# EasyEDA Pro project ProDocument_灰度传感器_2023-07-26.epro

# Schematic v1
Create Date: 2023-07-21; Page Name: P1; Project Name: 【2023电赛】2023年电赛控制术; Schematic Name: v1; Update Date: 2023-07-22; Company: 桂林信息科技学院; Drawed: Jsir2022; Page Size: A4; Reviewed: QQ1171690935; Version: V1
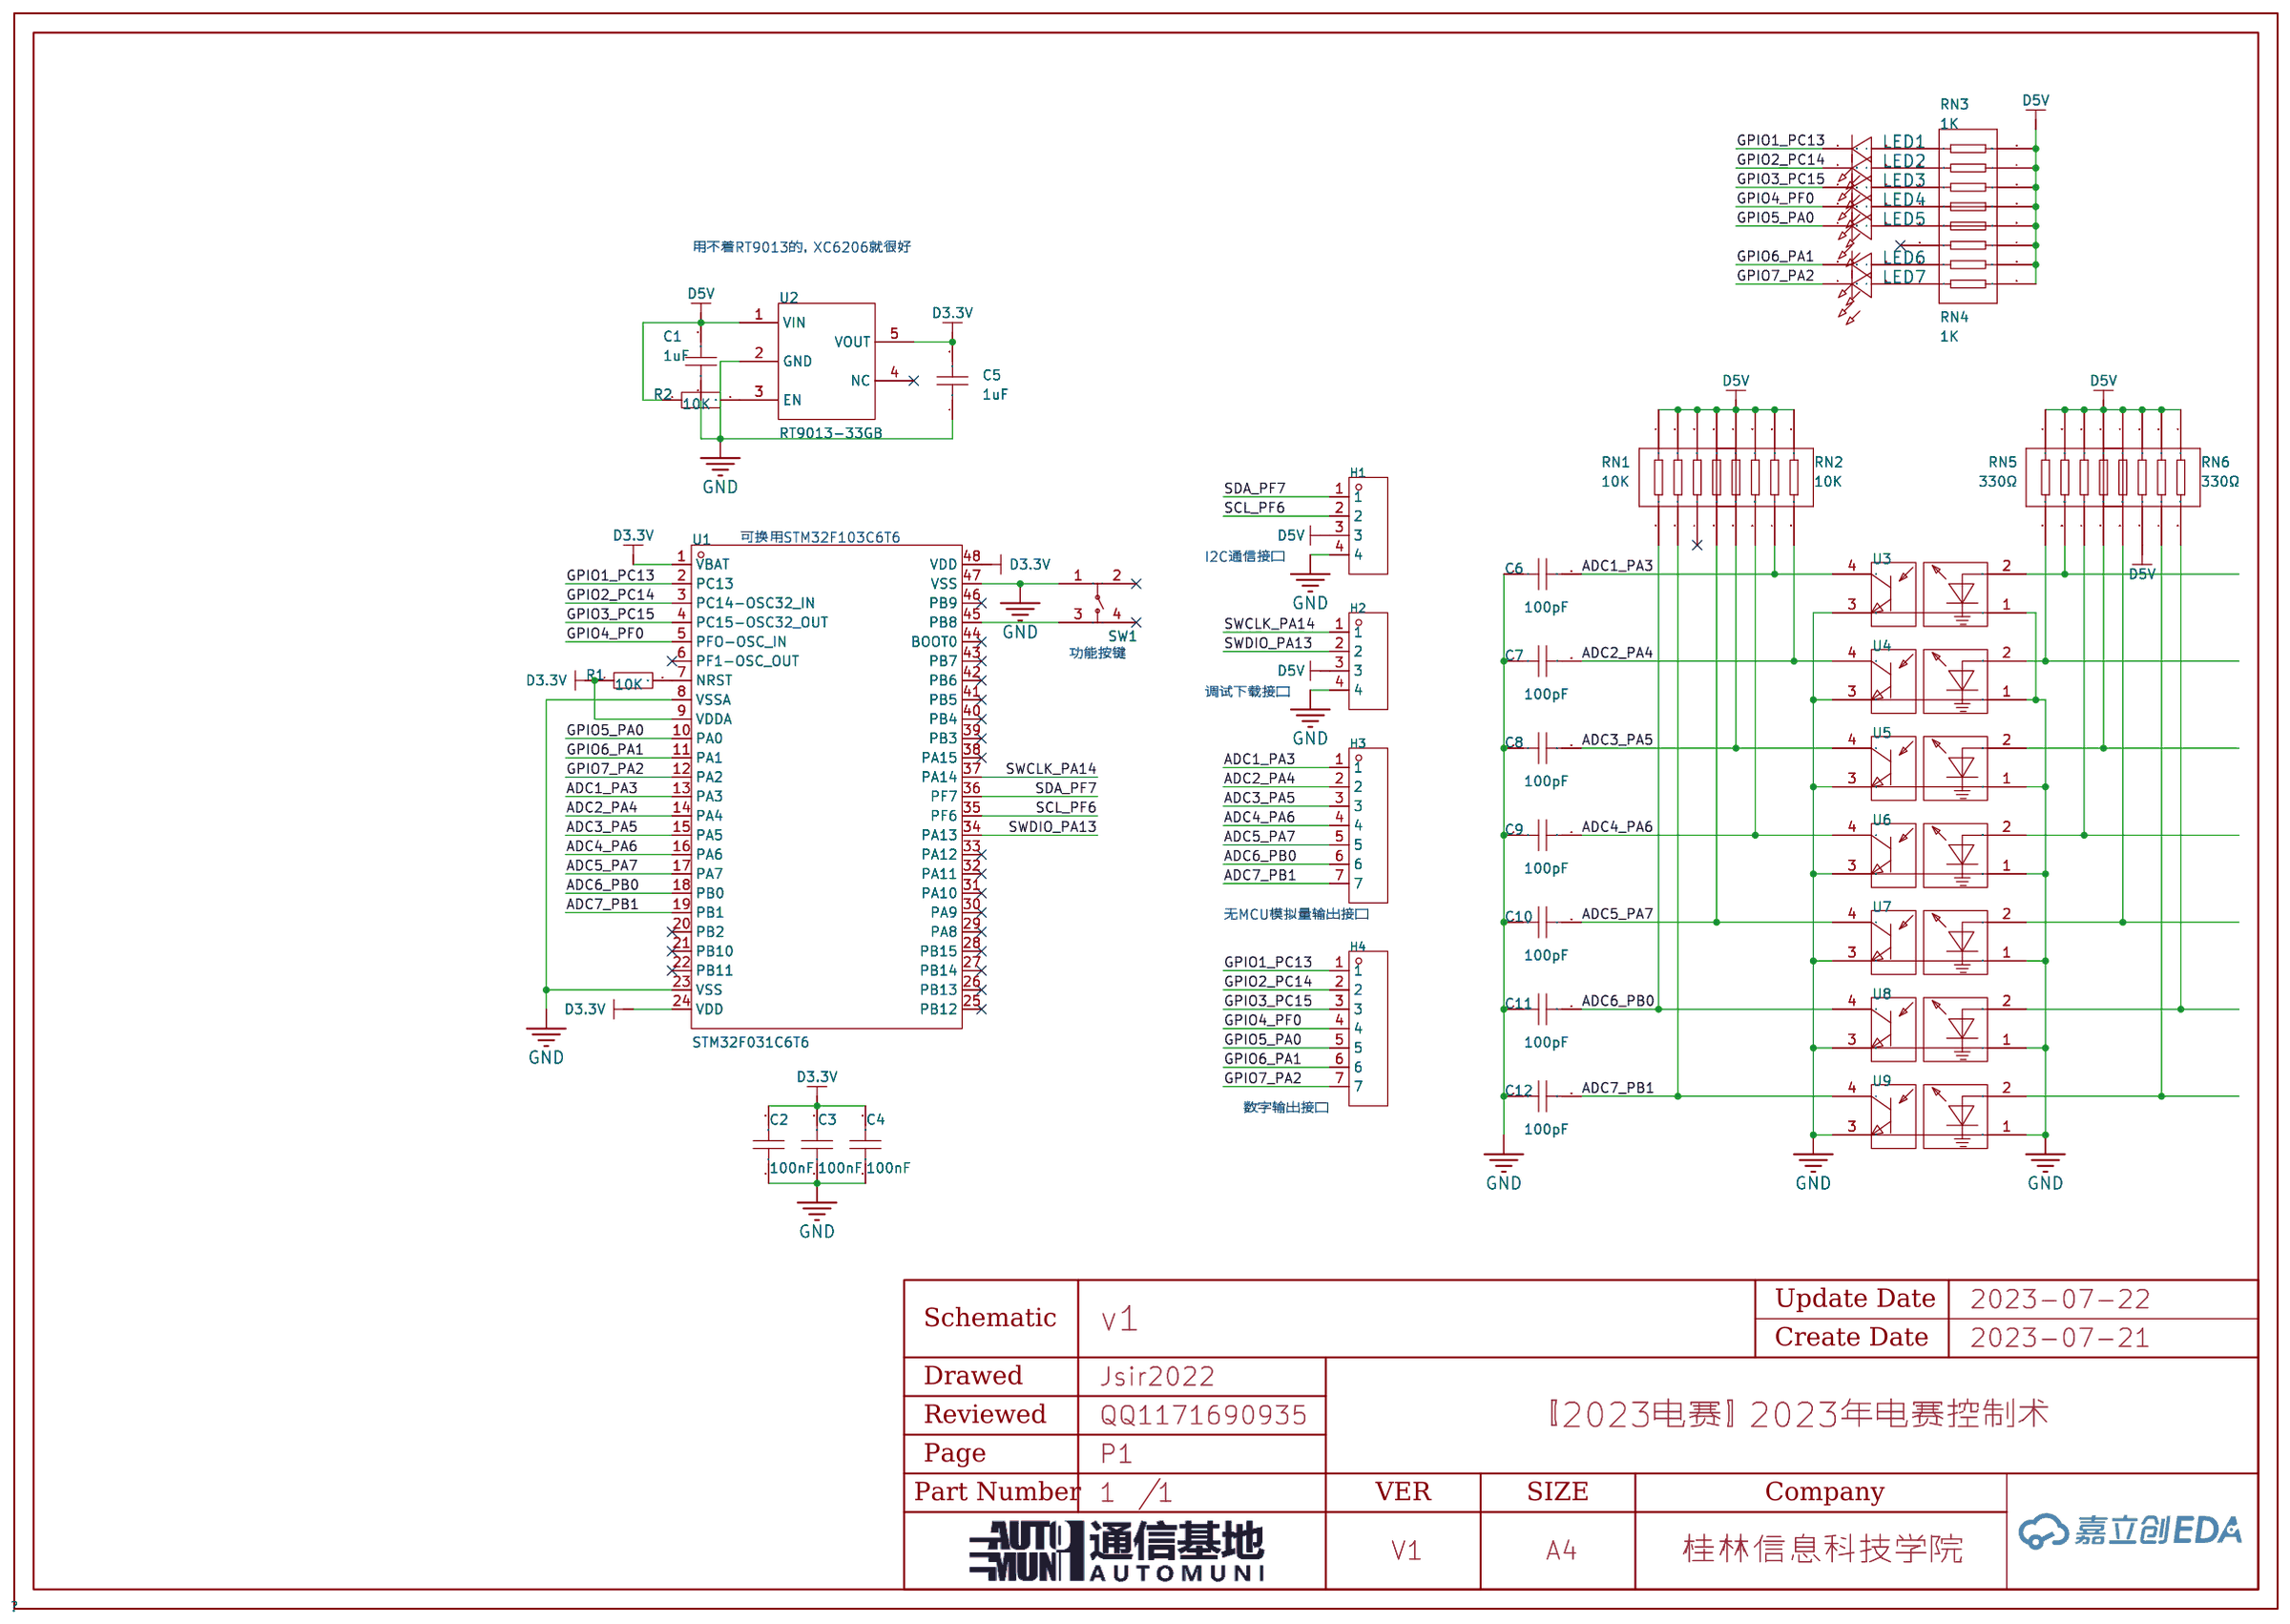
[diagram p0: schematic sheet]

## Parts
C1  1uF  [C0603]
C2  100nF  [C0603]
C3  100nF  [C0603]
C4  100nF  [C0603]
C5  1uF  [C0603]
C6  100pF  [C0603]
C7  100pF  [C0603]
C8  100pF  [C0603]
C9  100pF  [C0603]
C10  100pF  [C0603]
C11  100pF  [C0603]
C12  100pF  [C0603]
H1  -  [HDR-TH_4P-P2.54-V-M]
H2  -  [HDR-TH_4P-P2.54-V-M]
H3  -  [HDR-TH_7P-P2.54-V-M]
H4  -  [HDR-TH_7P-P2.54-V-M]
LED1  -  [LED_0603]
LED2  -  [LED_0603]
LED3  -  [LED_0603]
LED4  -  [LED_0603]
LED5  -  [LED_0603]
LED6  -  [LED_0603]
LED7  -  [LED_0603]
R1  10K  [R0603]
R2  10K  [R0603]
RN1  10K  [RES-ARRAY-SMD_0402-8P-L2.0-W1.0-BL]
RN2  10K  [RES-ARRAY-SMD_0402-8P-L2.0-W1.0-BL]
RN3  1K  [RES-ARRAY-SMD_0402-8P-L2.0-W1.0-BL]
RN4  1K  [RES-ARRAY-SMD_0402-8P-L2.0-W1.0-BL]
RN5  330Ω  [RES-ARRAY-SMD_0402-8P-L2.0-W1.0-BL]
RN6  330Ω  [RES-ARRAY-SMD_0402-8P-L2.0-W1.0-BL]
SW1  TS-1089S-AR02516  [SW-SMD_4P-L4.2-W3.3-P2.15-LS5.1]
U1  STM32F031C6T6  [LQFP-48_L7.0-W7.0-P0.50-LS9.0-BL]
U2  RT9013-33GB  [SOT-23-5_L3.0-W1.7-P0.95-LS2.8-BL]
U3  ITR9909  [OPTO-TH_ITR9909]
U4  ITR9909  [OPTO-TH_ITR9909]
U5  ITR9909  [OPTO-TH_ITR9909]
U6  ITR9909  [OPTO-TH_ITR9909]
U7  ITR9909  [OPTO-TH_ITR9909]
U8  ITR9909  [OPTO-TH_ITR9909]
U9  ITR9909  [OPTO-TH_ITR9909]

## Library data of the parts
C1-C12 = CAP_0603: Supplier Footprint: 0603
H1 H2 = HDR-M_2.54_1x4P: Supplier Part: C492403; Supplier Footprint: 插件
H3 H4 = HDR-M_2.54_1x7P: Supplier Part: C492406; Supplier Footprint: 插件
LED1-LED7 = LED_0603-R: Supplier Footprint: 0603
R1 R2 = Res_0603: Supplier Footprint: 0603
RN1-RN6 = YC124-JR-07330RL: 阻值:330Ω;精度:±5%;单个元件功率:62.5mW;电阻器数:4;; LCSC Part Name: 330Ω ±5% 0402x4; Supplier Part: C136846; Manufacturer: YAGEO(国巨); Supplier Footprint: 0402x4; JLCPCB Part Class: Extended Part; Datasheet: https://atta.szlcsc.com/upload/public/pdf/source/20171106/C136846_15099533593141092631.pdf; Supplier: LCSC; Tolerance: ±5%; Power(Watts): 62.5mW; Number of Resistors: 4; Number of Pins: 8; Temperature Coefficient: ±200ppm/℃
SW1 = TS-1089S-AR02516: 触点电流:50mA;额定电压(DC):12V;绝缘电阻:100MΩ;电路结构:单刀单掷;安装方式:立贴;按钮形状:椭圆形按钮;按钮/盖帽颜色:白色;作用力:160gf@±50gf;机械寿命:100000;工作温度:-30~+80;引脚样式:SMD接片;开关长度:4.2mm;开关宽度:3.25mm;开关高度:2.5mm;带支架:否;; LCSC Part Name: 342.5 160gf 轻触开关; Supplier Part: C720479; Manufacturer: XUNPU(讯普); Supplier Footprint: SMD; JLCPCB Part Class: Extended Part; Datasheet: https://atta.szlcsc.com/upload/public/pdf/source/20200810/C720479_389650BB8B865DD3822BD59B78D6CF64.pdf; Supplier: LCSC; Contact Current: 50mA; Voltage Rating (DC): 12V; Insulation Resistance: 100MΩ; Circuit: 单刀单掷; Mounting Style: 立贴; Actuator Style: 椭圆形按钮; Actuator/Cap Color: 白色; Operating Force: 160gf@±50gf; Mechanical Life: 100000; Operating Temperature: -30~+80; Pin Style: SMD接片; Switch Length: 4.2mm; Switch Width: 3.25mm; Switch Height: 2.5mm; Strike Gundam: 否
U1 = STM32F031C6T6: CPU内核:ARM Cortex-M0;CPU最大主频:48MHz;工作电压范围:2V~3.6V;内部振荡器:有;程序 FLASH容量:32K@x8bit;RAM总容量:4KB;EEPROM/数据 FLASH容量:-;GPIO端口数量:39;ADC(单元数/通道数/位数):1@x13ch/12bit;外设/功能/协议栈:DMA；看门狗；POR；PWM;工作温度范围:-40℃~+85℃;; LCSC Part Name: ARM Cortex-M0 48MHz 闪存：32K@x8bit RAM：4KB; Supplier Part: C97413; Manufacturer: ST(意法半导体); Supplier Footprint: LQFP-48(7x7); JLCPCB Part Class: Extended Part; Datasheet: https://atta.szlcsc.com/upload/public/pdf/source/20170925/C97413_1506321779757990583.pdf; Supplier: LCSC; CPU Core: ARM Cortex-M0; Maximum Frequency: 48MHz; Supply Voltage Range: 2V~3.6V; Internal Oscillator: 有; Program FLASH Size: 32K@x8bit; RAM Size: 4KB; GPIO Ports Number: 39; ADC (Units/Channels/bits): 1@x13ch/12bit; Peripherals / Functions / Protocol Stacks: DMA；看门狗；POR；PWM; Operating Temperature Range: -40℃~+85℃
U2 = RT9013-33GB: 输出类型:固定;输出极性:正;最大输入电压:5.5V;输出电压:3.3V;输出电流:500mA;电源纹波抑制比(PSRR):50dB@(10kHz);; Supplier Part: C47773; Manufacturer: RICHTEK(立锜); Supplier Footprint: SOT-23-5; JLCPCB Part Class: 扩展库; Datasheet: https://atta.szlcsc.com/upload/public/pdf/source/20150504/1457707282459.pdf; Supplier: LCSC; Output Type: 固定; Output Polarity: 正; Number of Outputs: 1; Maximum Input Voltage: 5.5V; Output Voltage: 3.3V; Dropout Voltage: 400mV@(500mA); Output Current: 500mA; Power Supply Rejection Ratio (PSRR): 50dB@(10kHz)
U3-U9 = ITR9909: Supplier Part: C53399; Manufacturer: EVERLIGHT(台湾亿光); Supplier Footprint: DIP-4; JLCPCB Part Class: Extended Part; Datasheet: https://atta.szlcsc.com/upload/public/pdf/source/20201022/C53399_E5C79523D84B21DC4419F8E709CCCF2E.pdf; Supplier: LCSC

## Nets
D3.3V: C2.2 C3.2 C4.2 C5.2 R1.1 U1.1(VBAT) U1.9(VDDA) U1.24(VDD) U1.48(VDD) U2.5(VOUT)
D5V: C1.2 H1.3 H2.3 R2.1 RN1.1 RN1.2 RN1.3 RN1.4 RN2.1 RN2.2 RN2.3 RN2.4 RN3.5 RN3.6 RN3.7 RN3.8 RN4.5 RN4.6 RN4.7 RN4.8 RN5.1 RN5.2 RN5.3 RN5.4 RN6.1 RN6.2 RN6.3 RN6.4 RN6.6 U2.1(VIN)
GND: C1.1 C2.1 C3.1 C4.1 C5.1 C6.1 C7.1 C8.1 C9.1 C10.1 C11.1 C12.1 H1.4 H2.4 SW1.1 U1.8(VSSA) U1.23(VSS) U1.47(VSS) U2.2(GND) U3.1 U3.3 U4.1 U4.3 U5.1 U5.3 U6.1 U6.3 U7.1 U7.3 U8.1 U8.3 U9.1 U9.3
ADC1_PA3: C6.2 H3.1 RN2.7 U1.13(PA3) U3.4
ADC2_PA4: C7.2 H3.2 RN2.8 U1.14(PA4) U4.4
ADC3_PA5: C8.2 H3.3 RN2.5 U1.15(PA5) U5.4
ADC4_PA6: C9.2 H3.4 RN2.6 U1.16(PA6) U6.4
ADC5_PA7: C10.2 H3.5 RN1.8 U1.17(PA7) U7.4
ADC6_PB0: C11.2 H3.6 RN1.5 U1.18(PB0) U8.4
ADC7_PB1: C12.2 H3.7 RN1.6 U1.19(PB1) U9.4
GPIO1_PC13: H4.1 LED1.1(C) U1.2(PC13)
GPIO2_PC14: H4.2 LED2.1(C) U1.3(PC14-OSC32_IN)
GPIO3_PC15: H4.3 LED3.1(C) U1.4(PC15-OSC32_OUT)
GPIO4_PF0: H4.4 LED4.1(C) U1.5(PFO-OSC_IN)
GPIO5_PA0: H4.5 LED5.1(C) U1.10(PA0)
GPIO6_PA1: H4.6 LED6.1(C) U1.11(PA1)
GPIO7_PA2: H4.7 LED7.1(C) U1.12(PA2)
SCL_PF6: H1.2 U1.35(PF6)
SDA_PF7: H1.1 U1.36(PF7)
SWCLK_PA14: H2.1 U1.37(PA14)
SWDIO_PA13: H2.2 U1.34(PA13)
$1N2447: R1.2 U1.7(NRST)
$1N4175: LED1.2(A) RN3.1
$1N4229: LED2.2(A) RN3.2
$1N4256: LED3.2(A) RN3.3
$1N4283: LED4.2(A) RN3.4
$1N4310: LED5.2(A) RN4.1
$1N5229: SW1.3 U1.45(PB8)
$1N5545: R2.2 U2.3(EN)
$1N6315: RN5.7 U6.2
$1N6322: RN5.8 U5.2
$1N6336: RN5.5 U4.2
$1N6418: RN5.6 U3.2
$1N6450: RN6.5 U7.2
$1N6471: RN6.8 U8.2
$1N6478: RN6.7 U9.2
$1N6514: LED7.2(A) RN4.4
$1N6542: LED6.2(A) RN4.3

Not connected (* = marked no-connect by the designer): RN1 7*; RN4 2*; SW1 2* 4*; U1 6(PF1-OSC_OUT)* 20(PB2)* 21(PB10)* 22(PB11)* 25(PB12)* 26(PB13)* 27(PB14)* 28(PB15)* 29(PA8)* 30(PA9)* 31(PA10)* 32(PA11)* 33(PA12)* 38(PA15)* 39(PB3)* 40(PB4)* 41(PB5)* 42(PB6)* 43(PB7)* 44(BOOT0)* 46(PB9)*; U2 4(NC)*

## Notes on the sheet
- 用不着RT9013的，XC6206就很好
- 可换用STM32F103C6T6
- I2C通信接口
- 功能按键
- 调试下载接口
- 无MCU模拟量输出接口
- 数字输出接口

# Board v1
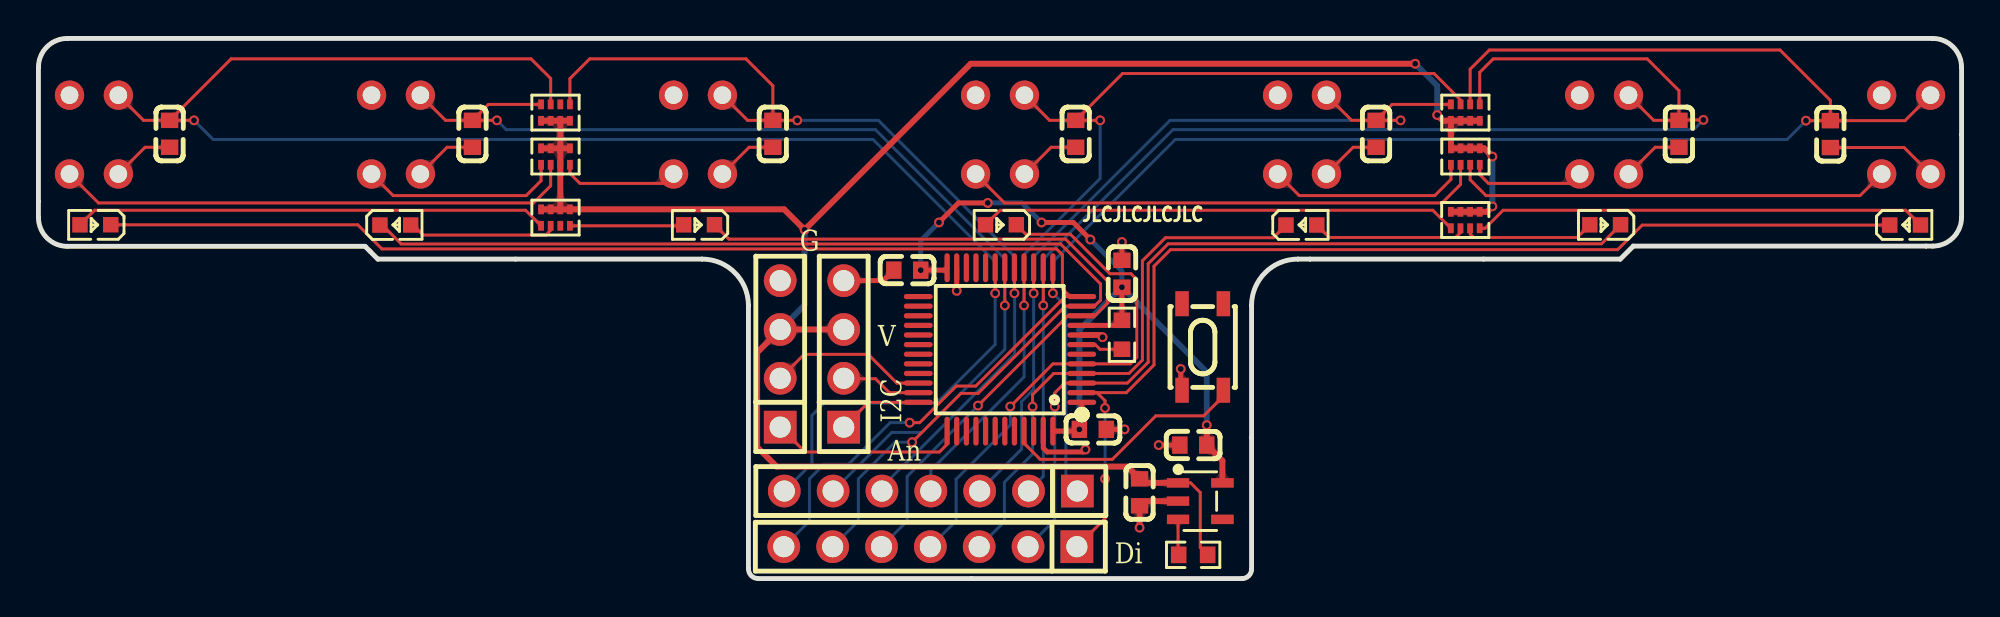
[diagram p1: board, top side]
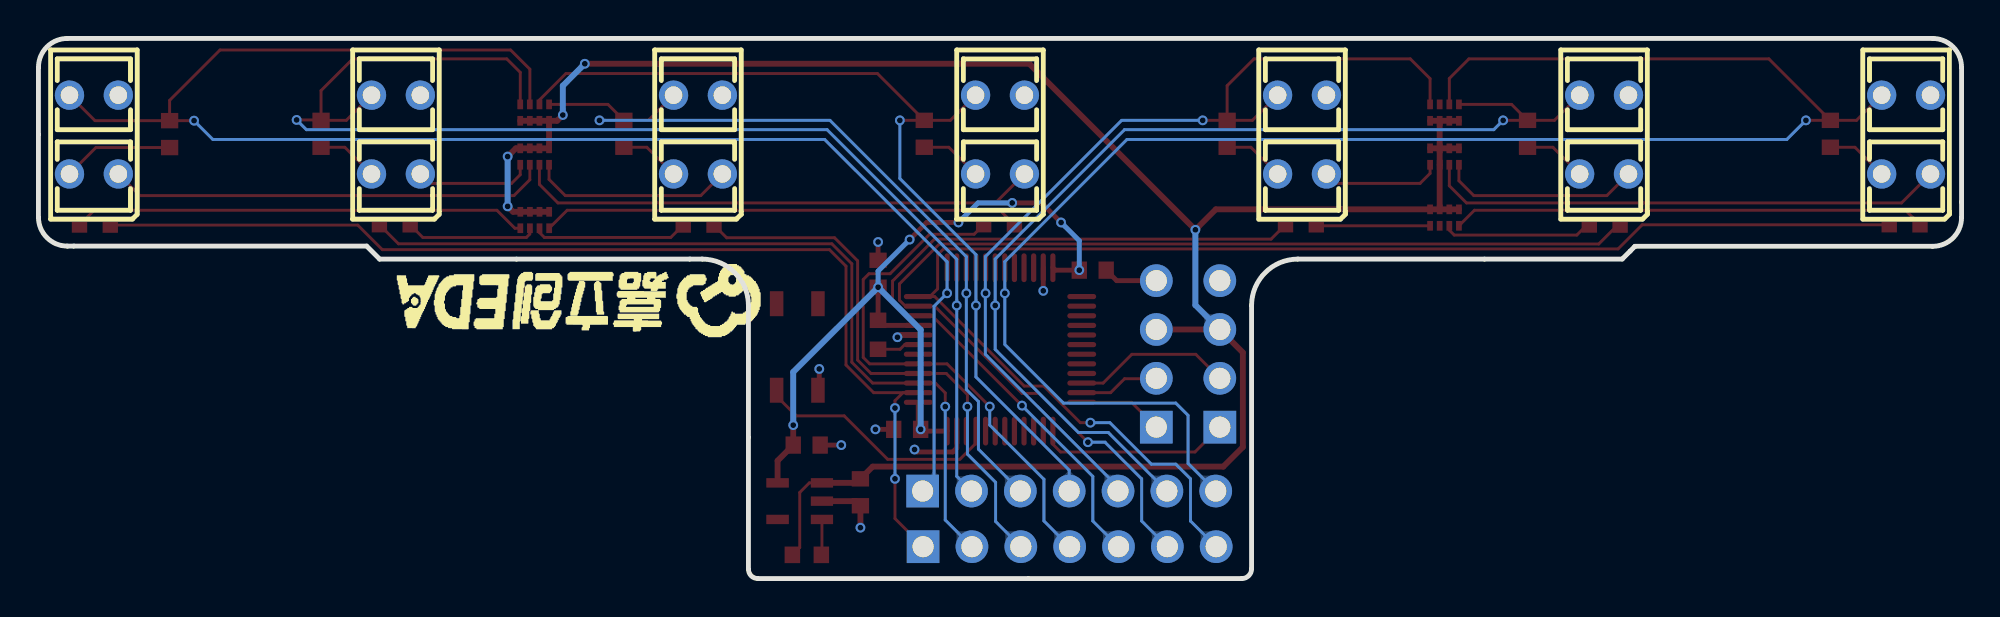
[diagram p2: board, bottom side, seen from below]

Outline 100 x 28.09 mm; copper layers: Top Layer, Bottom Layer. Coordinates in mm from the lower left corner of the outline.
Outline path: 0,26.59 arc(0.44,27.65) 1.5,28.09 98.5,28.09 arc(99.56,27.65) 100,26.59 100,18.79 arc(99.56,17.73) 98.5,17.29 82.93,17.29 82.26,16.62 65.49,16.62 arc(63.79,15.91) 63.08,14.2 63.08,0.49 arc(62.94,0.14) 62.59,0 37.43,0 arc(37.07,0.15) 36.92,0.51 36.92,14.2 arc(36.21,15.91) 34.51,16.62 17.65,16.62 16.98,17.28 1.5,17.28 arc(0.44,17.72) 0,18.78 0,26.59
Stack: Top Layer 0.035mm / Dielectric1 1.51mm FR4 er 4.5 / Bottom Layer 0.035mm

## Design rules (mm)
template: JLCPCB Capability(Two Layers Board)
spacing copperThickness1oz (default): track to track 0.102, other pairs 0.152 to 0.3
spacing copperThickness2oz: track to track 0.203, other pairs 0.152 to 0.3
track width copperThickness1oz (default): min 0.127, default 0.254, max 2.54
track width copperThickness2oz: min 0.203, default 0.254, max 2.54
differential pair differentialPair (default): width min 0.127, default 0.254, max 2.54; gap min 0.152, default 0.152
via viaSize (default): diameter min 0.5, default 0.61, max 10; hole min 0.3, default 0.305, max 6.3

## Placement (name value [footprint] x y rotation side)
C1  1uF  [C0603]  57.26 4.49 90 top
C2  100nF  [C0603]  54.83 7.76 180 top
C3  100nF  [C0603]  56.34 15.85 270 top
C4  100nF  [C0603]  45.18 16.04 0 top
C5  1uF  [C0603]  60.05 6.94 0 top
C6  100pF  [C0603]  93.18 23.12 90 top
C7  100pF  [C0603]  85.31 23.13 90 top
C8  100pF  [C0603]  69.56 23.13 90 top
C9  100pF  [C0603]  53.94 23.13 90 top
C10  100pF  [C0603]  38.19 23.13 90 top
C11  100pF  [C0603]  22.57 23.13 90 top
C12  100pF  [C0603]  6.82 23.13 90 top
H1  -  [HDR-TH_4P-P2.54-V-M]  41.87 11.69 90 top
H2  -  [HDR-TH_4P-P2.54-V-M]  38.57 11.69 90 top
H3  -  [HDR-TH_7P-P2.54-V-M]  46.4 4.55 180 top
H4  -  [HDR-TH_7P-P2.54-V-M]  46.38 1.66 180 top
LED1  -  [LED_0603]  97.12 18.39 0 top
LED2  -  [LED_0603]  81.42 18.39 180 top
LED3  -  [LED_0603]  65.72 18.39 0 top
LED4  -  [LED_0603]  50 18.39 180 top
LED5  -  [LED_0603]  34.3 18.39 180 top
LED6  -  [LED_0603]  18.61 18.39 0 top
LED7  -  [LED_0603]  2.91 18.39 180 top
R1  10K  [R0603]  56.34 12.68 270 top
R2  10K  [R0603]  60.04 1.23 180 top
RN1  10K  [RES-ARRAY-SMD_0402-8P-L2.0-W1.0-BL]  26.89 24.24 180 top
RN2  10K  [RES-ARRAY-SMD_0402-8P-L2.0-W1.0-BL]  74.2 24.24 180 top
RN3  1K  [RES-ARRAY-SMD_0402-8P-L2.0-W1.0-BL]  74.19 18.65 180 top
RN4  1K  [RES-ARRAY-SMD_0402-8P-L2.0-W1.0-BL]  26.89 18.78 180 top
RN5  330Ω  [RES-ARRAY-SMD_0402-8P-L2.0-W1.0-BL]  74.2 21.95 0 top
RN6  330Ω  [RES-ARRAY-SMD_0402-8P-L2.0-W1.0-BL]  26.89 21.95 0 top
SW1  TS-1089S-AR02516  [SW-SMD_4P-L4.2-W3.3-P2.15-LS5.1]  60.54 12.04 90 top
U1  STM32F031C6T6  [LQFP-48_L7.0-W7.0-P0.50-LS9.0-BL]  50 11.92 90 top
U2  RT9013-33GB  [SOT-23-5_L3.0-W1.7-P0.95-LS2.8-BL]  60.41 4.03 270 top
U3  ITR9909  [OPTO-TH_ITR9909]  97.12 23.09 90 bottom
U4  ITR9909  [OPTO-TH_ITR9909]  81.41 23.09 90 bottom
U5  ITR9909  [OPTO-TH_ITR9909]  65.71 23.09 90 bottom
U6  ITR9909  [OPTO-TH_ITR9909]  50 23.09 90 bottom
U7  ITR9909  [OPTO-TH_ITR9909]  34.29 23.09 90 bottom
U8  ITR9909  [OPTO-TH_ITR9909]  18.59 23.09 90 bottom
U9  ITR9909  [OPTO-TH_ITR9909]  2.88 23.09 90 bottom

## Footprints (pads in the part's own frame, mm; a bottom-side part is the same pattern mirrored in y, then rotated)
C0603
  rect 0.8x0.9 smd: 1(-0.7,0) 2(0.7,0)
HDR-TH_4P-P2.54-V-M
  rect 1.7x1.7 hole 1.1: 1(-3.81,0)
  round 1.7 hole 1.1: 2(-1.27,0) 3(1.27,0) 4(3.81,0)
HDR-TH_7P-P2.54-V-M
  rect 1.7x1.7 hole 1.1: 1(-7.62,0)
  round 1.7 hole 1.1: 2(-5.08,0) 3(-2.54,0) 4(0,0) 5(2.54,0) 6(5.08,0) 7(7.62,0)
LED_0603
  rect 0.8x0.8 smd: 1(-0.851,-0.01) 2(0.75,-0.005)
LQFP-48_L7.0-W7.0-P0.50-LS9.0-BL
  oval 0.27x1.5 smd: 1(-2.75,-4.25) 2(-2.25,-4.25) 3(-1.75,-4.25) 4(-1.25,-4.25) 5(-0.75,-4.25) 6(-0.25,-4.25) 7(0.25,-4.25) 8(0.75,-4.25) 9(1.25,-4.25) 10(1.75,-4.25) 11(2.25,-4.25) 12(2.75,-4.25) 25(2.75,4.25) 26(2.25,4.25) 27(1.75,4.25) 28(1.25,4.25) 29(0.75,4.25) 30(0.25,4.25) 31(-0.25,4.25) 32(-0.75,4.25) 33(-1.25,4.25) 34(-1.75,4.25) 35(-2.25,4.25) 36(-2.75,4.25)
  oval 1.5x0.27 smd: 13(4.25,-2.75) 14(4.25,-2.25) 15(4.25,-1.75) 16(4.25,-1.25) 17(4.25,-0.75) 18(4.25,-0.25) 19(4.25,0.25) 20(4.25,0.75) 21(4.25,1.25) 22(4.25,1.75) 23(4.25,2.25) 24(4.25,2.75) 37(-4.25,2.75) 38(-4.25,2.25) 39(-4.25,1.75) 40(-4.25,1.25) 41(-4.25,0.75) 42(-4.25,0.25) 43(-4.25,-0.25) 44(-4.25,-0.75) 45(-4.25,-1.25) 46(-4.25,-1.75) 47(-4.25,-2.25) 48(-4.25,-2.75)
OPTO-TH_ITR9909
  round 1.524 hole 0.914: 1(-2.05,1.27) 2(-2.05,-1.27) 3(2.05,-1.27) 4(2.05,1.27)
R0603
  rect 0.806x0.864 smd: 1(-0.753,0) 2(0.753,0)
RES-ARRAY-SMD_0402-8P-L2.0-W1.0-BL
  rect 0.3x0.505 smd: 1(-0.75,0.427) 2(-0.25,0.427) 3(0.25,0.427) 4(0.75,0.427) 5(0.75,-0.427) 6(0.25,-0.427) 7(-0.25,-0.427) 8(-0.75,-0.427)
SOT-23-5_L3.0-W1.7-P0.95-LS2.8-BL
  rect 0.49x1.157 smd: 1(-0.95,-1.153) 2(0,-1.153) 3(0.95,-1.153)
  rect 0.49x1.175 smd: 4(0.95,1.153) 5(-0.95,1.153)
SW-SMD_4P-L4.2-W3.3-P2.15-LS5.1
  rect 1.3x0.701 smd: 1(-2.251,1.075) 2(2.251,1.075) 3(-2.251,-1.075) 4(2.251,-1.075)

## Nets
As in the schematic.

Pads without a net: RN1 7; RN4 2; SW1 2 4; U1 6 20 21 22 25 26 27 28 29 30 31 32 33 38 39 40 41 42 43 44 46; U2 4

## Via types
v1: diameter 0.508, hole 0.305, Top Layer to Bottom Layer, 43 vias

## Routing (per net, layer and track width the routed paths; a pad name or vN(x,y) marks a point on that pad's centre or on a via; arc(x,y) is an arc through that point)
D3.3V: length 44
  Top Layer w0.254: v1(49.37,19.54) 47.84,19.54 v1(46.82,18.52) ; U1.1 54.25,7.88 v1(54.13,7.76) 54.03,7.67 U1.48 ; v1(45.88,16.04) 47.12,16.04 U1.24 ; v1(56.34,15.15) 56.34,13.44 R1.1 56.08,13.17 U1.9 ; v1(54.7,17.63) 53.81,18.52 v1(52.16,18.52)
  Top Layer w0.305: v1(60.75,7.98) C5.2 61.57,6.13 U2.5
  Bottom Layer w0.254: v1(56.34,15.15) 56.34,15.99 v1(54.7,17.63) ; v1(45.88,16.04) 45.88,17.57 v1(46.82,18.52) ; v1(52.16,18.52) 51.14,19.54 v1(49.37,19.54)
  Bottom Layer w0.305: v1(54.13,7.76) 54.13,12.94 v1(56.34,15.15) 60.75,10.74 v1(60.75,7.98)
D5V: length 114.2
  Top Layer w0.152: U2.1 59.91,4.98 60.41,4.48 60.41,1.62 R2.1
  Top Layer w0.305: RN2.4 RN2.2 74.95,23.81 ; RN2.4 73.03,23.81 v1(72.73,24.11) ; RN2.4 73.45,22.38 RN5.2 RN5.4 75.18,22.38 v1(75.6,21.95) ; RN3.5 RN3.6 RN3.7 RN3.8 75.32,19.08 v1(75.6,19.36) ; U2.1 57.47,4.98 C1.2 56.62,5.82 38.39,5.82 37.37,6.84 37.37,11.76 H2.3 H1.3 ; RN1.4 RN1.3 RN1.2 ; RN4.7 RN4.8 38.78,19.2 v1(39.84,18.14) 48.48,26.78 v1(71.59,26.78) ; RN4.7 RN4.6 RN4.5 ; RN4.7 RN6.6 RN6.3 ; RN1.2 RN1.1 ; RN1.2 RN6.3 ; RN6.3 RN6.4 ; RN6.3 RN6.2 RN6.1
  Bottom Layer w0.305: v1(75.6,21.95) v1(75.6,19.36) ; v1(39.84,18.14) 39.84,14.23 H2.3 ; v1(71.59,26.78) 72.73,25.63 v1(72.73,24.11)
GND: length 40.9
  Top Layer w0.152: C7.1 84.07,22.43 U4.1 ; C12.1 5.54,22.43 U9.1 ; C6.1 97.01,22.42 U3.1 ; U5.1 68.37,22.43 C8.1 ; C11.1 21.25,22.43 U8.1 ; U7.1 36.95,22.43 C10.1 ; U6.1 52.66,22.43 C9.1
  Top Layer w0.254: C3.1 v1(56.34,17.51) ; v1(54.44,6.71) 54.32,6.58 52.46,6.58 52.25,6.79 U1.47 ; U1.23 v1(47.75,14.97) ; H1.4 43.93,15.5 C4.1 ; C5.1 v1(58.25,6.94) ; C2.1 v1(56.48,7.76) ; SW1.1 59.4,9.86 v1(59.4,10.9)
  Top Layer w0.305: v1(57.26,2.65) C1.1 57.5,4.03 U2.2 ; v1(55.33,12.55) 55.22,12.67 U1.8
  Bottom Layer w0.254: v1(56.48,7.76) 56.48,7.73 ; v1(58.25,6.94) 58.25,6.96
  Bottom Layer w0.305: v1(57.26,2.65) 57.24,2.65
ADC1_PA3: length 86.1
  Top Layer w0.152: C6.2 93.18,24.87 90.56,27.49 75.45,27.49 74.45,26.49 74.45,24.68 74.46,24.67 ; C6.2 v1(91.91,23.82) ; C6.2 97.06,23.82 U3.4 ; U1.13 v1(52.75,14.84)
  Bottom Layer w0.152: H3.1 53.43,5.14 53.43,14.16 v1(52.75,14.84) 52.75,16.47 59.12,22.84 90.93,22.84 v1(91.91,23.82)
ADC2_PA4: length 70.6
  Top Layer w0.152: 74.95,24.69 74.95,26.33 75.65,27.03 83.66,27.03 85.31,25.38 C7.2 ; U1.14 v1(52.25,14.2) ; C7.2 83.99,23.83 U4.4 ; C7.2 85.33,23.86 v1(86.58,23.86)
  Bottom Layer w0.152: H3.2 52.25,5.32 v1(52.25,14.2) 52.25,16.61 58.99,23.35 86.07,23.35 v1(86.58,23.86)
ADC3_PA5: length 45.3
  Top Layer w0.152: RN2.5 70.39,24.66 C8.2 ; U5.4 68.29,23.83 C8.2 ; C8.2 v1(70.83,23.83) ; U1.15 v1(51.75,14.84)
  Bottom Layer w0.152: H3.3 51.12,6.73 51.12,9.21 51.75,9.84 v1(51.75,14.84) 51.75,16.74 58.84,23.83 v1(70.83,23.83)
ADC4_PA6: length 51.2
  Top Layer w0.152: U6.4 52.58,23.83 C9.2 ; 73.96,24.66 73.95,24.67 73.95,24.89 72.57,26.27 56.37,26.27 C9.2 ; C9.2 v1(55.21,23.83) ; U1.16 v1(51.25,14.2)
  Bottom Layer w0.152: v1(55.21,23.83) 55.21,20.81 51.25,16.85 v1(51.25,14.2) ; v1(51.25,14.2) 51.27,14.2 ; v1(51.25,14.2) 51.25,10.49 46.4,5.64 H3.4
ADC5_PA7: length 49.8
  Top Layer w0.152: C10.2 36.87,23.83 U7.4 ; C10.2 v1(39.46,23.83) ; C10.2 38.19,25.63 36.79,27.03 28.66,27.03 27.64,26 RN1.8 ; U1.17 v1(50.75,14.84)
  Bottom Layer w0.152: H3.5 43.86,4.77 50.76,11.67 50.76,14.83 v1(50.75,14.84) 50.76,14.85 50.76,16.74 43.67,23.83 v1(39.46,23.83)
ADC6_PB0: length 56.5
  Top Layer w0.152: C11.2 v1(23.84,23.83) ; C11.2 23.4,24.66 RN1.5 ; C11.2 21.17,23.83 U8.4 ; U1.18 v1(50.25,14.2)
  Bottom Layer w0.152: H3.6 44.37,7.6 45.93,7.6 50.25,11.92 v1(50.25,14.2) 50.25,16.62 43.52,23.35 24.32,23.35 v1(23.84,23.83) 23.84,23.86
ADC7_PB1: length 93.3
  Top Layer w0.152: RN1.6 26.64,26.01 25.62,27.03 10.02,27.03 C12.2 ; C12.2 v1(8.09,23.83) ; C12.2 5.46,23.83 U9.4 ; U1.19 v1(49.75,14.84)
  Bottom Layer w0.152: H3.7 40.22,5.99 40.22,8.49 40.86,9.12 46.7,9.12 49.75,12.18 v1(49.75,14.84) 49.75,16.49 43.4,22.84 9.08,22.84 v1(8.09,23.83) 8.09,23.86
GPIO1_PC13: length 57.4
  Top Layer w0.152: 55.04,9.67 55.46,9.25 v1(55.46,8.87) ; 55.04,9.67 56.57,9.67 58.01,11.11 58.01,16.25 58.87,17.11 82.12,17.11 83.4,18.38 LED1.1 ; 55.04,9.67 U1.2 ; H4.1 55.46,3.12 v1(55.46,5.19)
  Bottom Layer w0.152: v1(55.46,5.19) v1(55.46,8.87)
GPIO2_PC14: length 44.6
  Top Layer w0.152: v1(52.85,8.94) 52.85,9.66 53.36,10.17 U1.3 56.62,10.17 57.71,11.25 57.71,16.37 58.74,17.41 81.28,17.41 82.27,18.4
  Bottom Layer w0.152: H4.2 52.85,3.05 v1(52.85,8.94)
GPIO3_PC15: length 28.9
  Top Layer w0.152: LED3.1 64.21,17.73 58.6,17.73 57.4,16.53 57.4,11.37 56.71,10.67 U1.4 52.79,10.67 51.69,9.57 v1(51.69,8.94)
  Bottom Layer w0.152: H4.3 50.23,2.97 50.23,5.01 51.69,6.48 v1(51.69,8.94)
GPIO4_PF0: length 28.1
  Top Layer w0.152: v1(50.53,8.95) 52.75,11.17 U1.5 56.78,11.17 57.11,11.5 57.11,15.56 56.81,15.85 55.72,15.85 53.66,17.91 51.35,17.91 LED4.1
  Bottom Layer w0.152: v1(50.53,8.95) 50.53,7.98 47.71,5.16 47.71,2.99 H4.4
GPIO5_PA0: length 41.2
  Top Layer w0.152: LED5.1 35.9,17.65 53.41,17.65 55.59,15.47 55.59,14.33 54.95,13.7 54.28,13.7 ; U1.10 54.28,13.7 ; 54.28,13.7 53.56,13.7 v1(48.86,9)
  Bottom Layer w0.152: v1(48.86,9) 45.17,5.31 45.17,2.99 H4.5
GPIO6_PA1: length 60.2
  Top Layer w0.152: v1(45.43,7.09) 47.97,9.63 48.86,9.63 53.39,14.17 U1.11 54.92,14.17 55.23,14.48 55.23,15.33 53.15,17.4 18.87,17.4 17.75,18.51
  Bottom Layer w0.152: v1(45.43,7.09) 44.54,7.09 42.63,5.19 42.63,2.99 H4.6
GPIO7_PA2: length 74.6
  Top Layer w0.152: 53.64,14.67 53.4,14.67 48.74,10.01 47.72,10.01 45.82,8.11 v1(45.3,8.11) ; 53.64,14.67 53.24,15.07 53.24,16.84 52.94,17.15 17.86,17.15 16.61,18.4 3.76,18.4 ; 53.64,14.67 U1.12
  Bottom Layer w0.152: v1(45.3,8.11) 44.28,8.11 42.13,5.95 40.86,5.95 40.09,5.19 40.09,2.99 H4.7
SCL_PF6: length 4.2
  Top Layer w0.152: U1.35 44.25,9.67 43.52,10.39 41.89,10.39 H1.2
SDA_PF7: length 4.4
  Top Layer w0.152: H1.1 43.16,9.17 U1.36
SWCLK_PA14: length 9.4
  Top Layer w0.152: H2.1 39.86,6.58 46.85,6.58 47.25,6.98
SWDIO_PA13: length 8.3
  Top Layer w0.152: U1.34 44.64,10.17 43.14,11.66 39.82,11.66 H2.2
$1N2447: length 2.2
  Top Layer w0.152: U1.7 54.96,12.17 55.2,11.93 R1.2
$1N4175: length 23.6
  Top Layer w0.152: RN3.1 75.23,18.22 76.16,19.16 97.1,19.16 LED1.2
$1N4229: length 6.8
  Top Layer w0.152: 74.45,18.13 74.45,17.92 74.63,17.74 80.01,17.74 LED2.2
$1N4256: length 8.1
  Top Layer w0.152: LED3.2 67.12,17.74 73.69,17.74 73.94,17.99 73.94,18.21 73.94,18.21
$1N4283: length 24.9
  Top Layer w0.152: LED4.2 50.01,19.16 72.51,19.16 RN3.4
$1N4310: length 5.9
  Top Layer w0.152: RN4.1 33.5,18.35 LED5.2
$1N5229: length 13
  Top Layer w0.152: U1.45 51.25,7.04 52.09,6.2 55.84,6.2 58.1,8.46 60.59,8.46 61.62,9.49 SW1.3
$1N5545: length 1.9
  Top Layer w0.152: U2.3 59.26,1.26 59.29,1.23
$1N6315: length 27.3
  Top Layer w0.152: RN5.7 73.95,20.5 72.99,19.54 50.24,19.54 U6.2
$1N6322: length 10.6
  Top Layer w0.152: U5.2 65.56,19.92 72.61,19.92 73.45,20.76 73.45,21.52
$1N6336: length 6.1
  Top Layer w0.152: RN5.5 74.95,21 75.4,20.55 79.65,20.55 U4.2
$1N6418: length 23
  Top Layer w0.152: 95.85,21.04 94.72,19.92 75.27,19.92 74.45,20.74 74.45,21.52
$1N6450: length 6.3
  Top Layer w0.152: U7.2 32.53,20.55 28.16,20.55 27.64,21.07 RN6.5
$1N6471: length 10.4
  Top Layer w0.152: U8.2 18.44,19.92 25.36,19.92 26.14,20.69 RN6.8
$1N6478: length 27.1
  Top Layer w0.152: U9.2 3.12,19.54 25.74,19.54 26.64,20.43 RN6.7
$1N6514: length 24.6
  Top Layer w0.152: RN4.4 25.33,19.16 2.92,19.16 LED7.2
$1N6542: length 7.9
  Top Layer w0.152: 19.36,18.52 20.01,17.87 26.38,17.87 26.64,18.12 RN4.3

## Copper pours and planes (outline as drawn; the poured copper is in the pictures)
GND on Bottom Layer: -7.66,35.41 104.74,35.41 104.74,-11.96 -7.66,-11.96

Small or netless copper shapes (teardrops, artwork), in the pictures only: 232 on Top Layer, 58 on Bottom Layer

## Text on the board
Top Silkscreen Layer: JLCJLCJLCJLC | G | V | An | Di | I2C
